# Altium schematic sheet DCDC_12V.SchDoc
size 420 x 297 mm; SheetNumber: 3; SheetTotal: 5
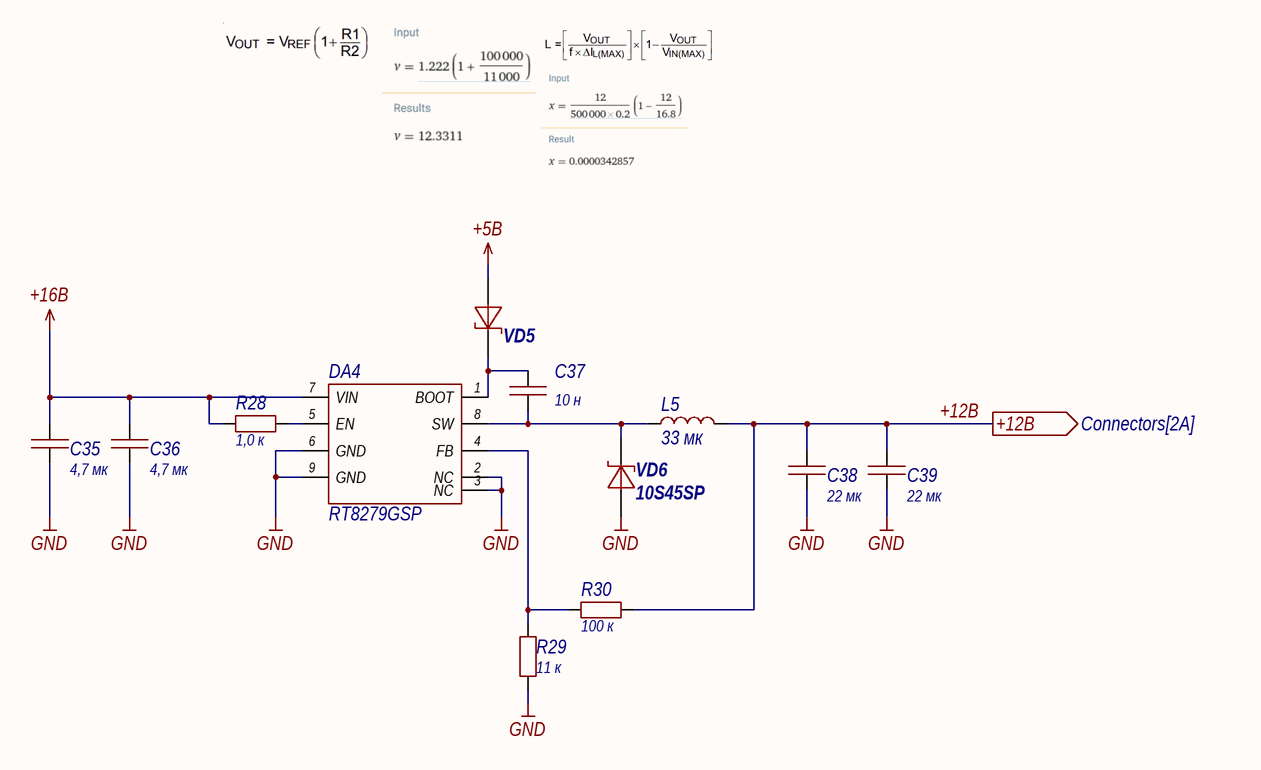
[diagram p0: DCDC_12V.SchDoc]

## Parts
C35  value 4,7 мк  [1206C]  (hidden comment: Capacitor)
C36  value 4,7 мк  [1206C]  (hidden comment: Capacitor)
C37  value 10 н  [0603C]  (hidden comment: Capacitor)
C38  value 22 мк  [1210C]  (hidden comment: Capacitor)
C39  value 22 мк  [1210C]  (hidden comment: Capacitor)
DA4  RT8279GSP  [8SOP(Exposed_Pad)]
L5  value 33 мк  [IHLP-4040]  (hidden comment: IHLP4040DZER330M11)
R28  value 1,0 к  [0603R]  (hidden comment: Resistor)
R29  value 11 к  [0603R]  (hidden comment: Resistor)
R30  value 100 к  [0603R]  (hidden comment: Resistor)
VD5  BAT54WS  [SOD-323]  (value not drawn)
VD6  10S45SP  [TO-277]

## Ports
+12В (out, see Connectors[2A])

## Nets
+5В: VD5.1
+16В: C35.2 C36.2 DA4.7(VIN) R28.2
GND: C35.1 C36.1 C38.1 C39.1 DA4.2(NC) DA4.3(NC) DA4.6(GND) DA4.9(GND) R29.1 VD6.1
+12В: C38.2 C39.2 L5.2 R30.2 ; port +12В
NetC37_1: C37.1 DA4.8(SW) L5.1 VD6.2
NetC37_2: C37.2 DA4.1(BOOT) VD5.2
NetDA4_4: DA4.4(FB) R29.2 R30.1
NetDA4_5: DA4.5(EN) R28.1

## Notes on the sheet
- Перв. примен.
- Справ. №
- Подп. и дата
- Инв. № дубл.
- Взам. инв. №
- Инв. № подл.
- Изм.
- Лист
- № докум.
- Подп.
- Дата
- Копировал
- Формат А3

## Library data of the parts
C35 C36 = Capacitor_4,7u_10_50V_X7R_1206C: Конденсатор; Library Path2: Schematic\Capacitor.SchLib; Tolerance: 0,1; Voltage (V): 50; Dielectric: X7R; Capacity (nF): 4700; Part Number: Capacitor_4,7u_10_50V_X7R_1206C
C37 = Capacitor_10n_10_50V_X7R_0603C: Конденсатор; Library Path2: Schematic\Capacitor.SchLib; Tolerance: 0,1; Voltage (V): 50; Dielectric: X7R; Capacity (nF): 10; Part Number: Capacitor_10n_10_50V_X7R_0603C
C38 C39 = Capacitor_22u_10_25V_X7R_1210C: Конденсатор; Library Path2: Schematic\Capacitor.SchLib; Tolerance: 0,1; Voltage (V): 25; Dielectric: X7R; Capacity (nF): 22000; Part Number: Capacitor_22u_10_25V_X7R_1210C
DA4 = RT8279GSP: Преобразователь постоянного тока понижающий подстраиваемый выход 5А; Part Number: RT8279GSP
L5 = IHLP4040DZER330M11: ЧИП-индуктивность экранированная 33мкГн ±20% 4,4A 94,5мОм 4040; Inductance (μH): 33; Current (A): 4,4; Part Number: IHLP4040DZER330M11
R28 = Resistor_1.0k_1_0603: Резистор номиналом 1,0 кОм и точностью 1%; Power: *; Part Number: Resistor_1.0k_1_0603; Tolerance: 1%
R29 = Resistor_11k_1_0603: Резистор номиналом 11 кОм и точностью 1%; Power: *; Part Number: Resistor_11k_1_0603; Tolerance: 1%
R30 = Resistor_100k_1_0603: Резистор номиналом 100 кОм и точностью 1%; Power: *; Part Number: Resistor_100k_1_0603; Tolerance: 1%
VD5 = BAT54WS: Диод шоттки на 30 В, ном. ток 0.2 А; Voltage nominal (V): 30; Current (A): 0.2; Part Number: BAT54WS
VD6 = 10S45SP: Диод шоттки на 45 В, ном. ток 10 А; Voltage nominal (V): 45; Current (A): 10; Part Number: 10S45SP